# Altium schematic sheet RF.SchDoc
size A4; SheetNumber: 4; SheetTotal: 5
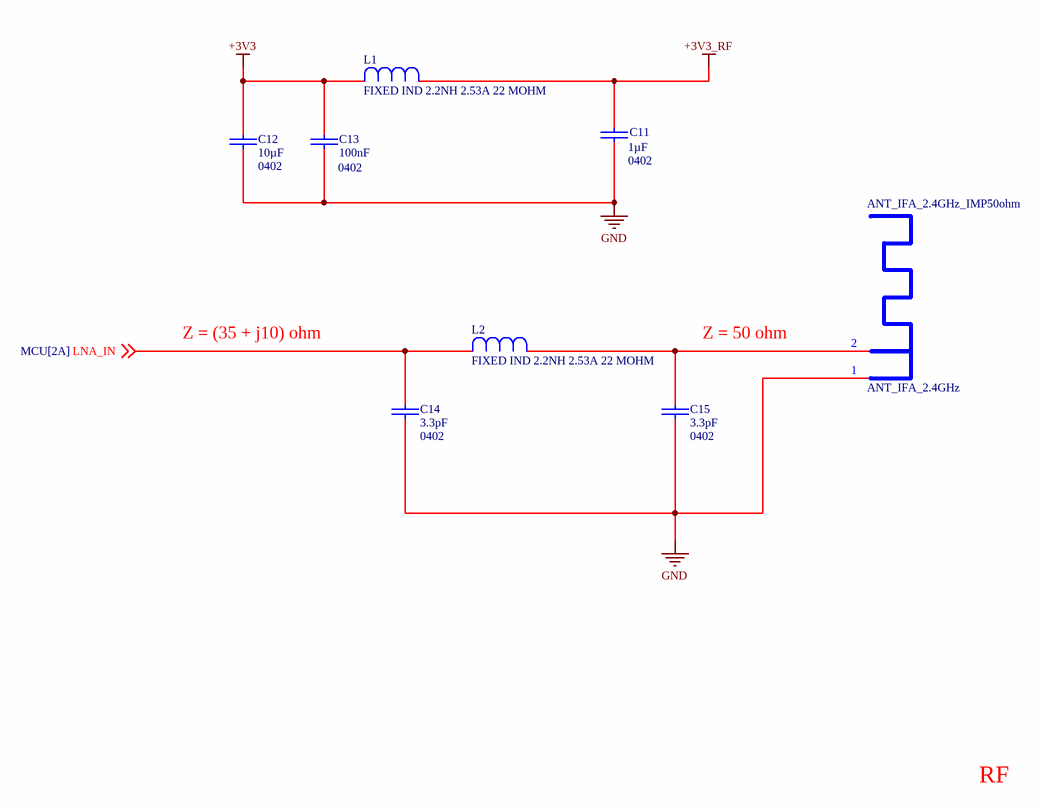
[diagram p0: RF.SchDoc]

## Parts
ANT_IFA_2.4GHz_IMP50ohm  ANT_IFA_2.4GHz  [ANT_IFA_2.4GHz]
C11  value 1µF  Case/Package: 0402  [C0402]  (hidden comment: CAP CER 1UF 10V X5R 0402)
C12  value 10µF  Case/Package: 0402  [C0402]  (hidden comment: CAP CER 10UF 10V X5R 0402)
C13  value 100nF  Case/Package: 0402  [C0402]  (hidden comment: CAP CER 100nF 50V X5R 0402)
C14  value 3.3pF  Case/Package: 0402  [C0402]  (hidden comment: GRM1555C2A3R3CA01D)
C15  value 3.3pF  Case/Package: 0402  [C0402]  (hidden comment: GRM1555C2A3R3CA01D)
L1  FIXED IND 2.2NH 2.53A 22 MOHM  [INDC1006X60N]
L2  FIXED IND 2.2NH 2.53A 22 MOHM  [INDC1006X60N]

## Nets
+3V3: C12.2 C13.2 L1.2
+3V3_RF: C11.2 L1.1
GND: ANT_IFA_2.4GHz_IMP50ohm.1 C11.1 C12.1 C13.1 C14.1 C15.1
LNA_IN: C14.2 L2.2 ; off-sheet LNA_IN
NetANT_IFA_2.4GHz_IMP50ohm_2: ANT_IFA_2.4GHz_IMP50ohm.2 C15.2 L2.1

## Notes on the sheet
- Z = (35 + j10) ohm
- Z = 50 ohm
- RF

## Library data of the parts
C11 = CC0402KRX5R6BB105: Multilayer Ceramic Capacitors MLCC – SMD/SMT; YAGEO; CC0402KRX5R6BB105; 1 µF; 0402; 10 V; 10 V; Manufacturer: Yageo Group; Dissipation Factor: 15%; Temperature Coefficient: 30ppm/°C; Tolerance: 10%; Supplier: DigiKey; Supplier Part Number: 311-1439-1-ND; Manufacturer Part Number: CC0402KRX5R6BB105; RoHS: Compliant; Category: Ceramic Capacitors; Stock: 575623; Pricing: 1=0,11, 10=0,06, 50=0,0412, 100=0,0356, 500=0,02612, 1000=0,02323, 2500=0,02018, 5000=0,01835 (USD); Case Code (Imperial): 0402; Case Code (Metric): 1005; China RoHS: Compliant; Composition: Ceramic; Country of Origin: Mainland China, Taiwan; Depth: 500µm; Dielectric: X5R; Dielectric Material: Ceramic; Export Control Classification Number (ECCN) Code: EAR99; Halogen Free: Halogen Free; Height: 500µm; Harmonized Tariff Schedule (HTS) Code: 8532.24.00.20; Introduction Date: 2009-04-16; Lead Free: Lead Free; Length: 1mm; Lifecycle Status: Production; Material: Ceramic; Max Operating Temperature: 85°C; Min Operating Temperature: -55°C; Mounting Technology: Surface Mount; Pins: 2; Number of Terminals: 2; Packaging: Cut Tape (CT); Radiation Hardening: No; REACH SVHC: Yes; Schedule B: 8532240020, 8532240020|8532240020|8532240020|8532240020|8532240020|8532240020|8532240020|8532240020|8532240020|8532240020|8532240020|8532240020|8532240020|8532240020|8532240020|8532240020|8532240020|8532240020|8532240020|8532240020|8532240020|8532240020|8532240020|85; Termination: SMD/SMT; Thickness: 558.8µm; Voltage Rating: 10V; Voltage Rating (DC): 10V; Width: 500µm; ComponentLink1URL: https://datasheet.octopart.com:443/CC0402KRX5R6BB105-Yageo-datasheet-170350636.pdf?src-supplier=IHS; ComponentLink1Description: https://datasheet.octopart.com:443/CC0402KRX5R6BB105-Yageo-datasheet-170350636.pdf?src-supplier=IHS; ComponentLink2URL: https://datasheet.octopart.com:443/CC0402KRX5R6BB105-Yageo-datasheet-10911834.pdf?src-supplier=Farnell; ComponentLink2Description: https://datasheet.octopart.com:443/CC0402KRX5R6BB105-Yageo-datasheet-10911834.pdf?src-supplier=Farnell; ComponentLink3URL: https://datasheet.octopart.com:443/CC0402KRX5R6BB105-Yageo-datasheet-78855684.pdf?src-supplier=Upverter; ComponentLink3Description: https://datasheet.octopart.com:443/CC0402KRX5R6BB105-Yageo-datasheet-78855684.pdf?src-supplier=Upverter; ComponentLink4URL: https://datasheet.octopart.com:443/CC0402KRX5R6BB105-Yageo-datasheet-8324442.pdf?src-supplier=element14+APAC; ComponentLink4Description: https://datasheet.octopart.com:443/CC0402KRX5R6BB105-Yageo-datasheet-8324442.pdf?src-supplier=element14+APAC; ComponentLink5URL: https://datasheet.octopart.com:443/CC0402KRX5R6BB105-Yageo-datasheet-181967186.pdf?src-supplier=Newark; ComponentLink5Description: https://datasheet.octopart.com:443/CC0402KRX5R6BB105-Yageo-datasheet-181967186.pdf?src-supplier=Newark; ComponentLink6URL: https://datasheet.octopart.com:443/CC0402KRX5R6BB105-Yageo-datasheet-181967185.pdf?src-supplier=Newark; ComponentLink6Description: https://datasheet.octopart.com:443/CC0402KRX5R6BB105-Yageo-datasheet-181967185.pdf?src-supplier=Newark; ComponentLink7URL: https://datasheet.octopart.com:443/CC0402KRX5R6BB105-Yageo-datasheet-519481.pdf?src-supplier=Newark; ComponentLink7Description: https://datasheet.octopart.com:443/CC0402KRX5R6BB105-Yageo-datasheet-519481.pdf?src-supplier=Newark; ComponentLink8URL: https://datasheet.octopart.com:443/CC0402KRX5R6BB105-Yageo-datasheet-62067349.pdf?src-supplier=Newark; ComponentLink8Description: https://datasheet.octopart.com:443/CC0402KRX5R6BB105-Yageo-datasheet-62067349.pdf?src-supplier=Newark; ComponentLink9URL: https://datasheet.octopart.com:443/CC0402KRX5R6BB105-Yageo-datasheet-169689537.pdf?src-supplier=Newark; ComponentLink9Description: https://datasheet.octopart.com:443/CC0402KRX5R6BB105-Yageo-datasheet-169689537.pdf?src-supplier=Newark; ComponentLink10URL: https://datasheet.octopart.com:443/CC0402KRX5R6BB105-Yageo-datasheet-158238148.pdf?src-supplier=JRH+Electronics; ComponentLink10Description: https://datasheet.octopart.com:443/CC0402KRX5R6BB105-Yageo-datasheet-158238148.pdf?src-supplier=JRH+Electronics; ComponentLink11URL: https://datasheet.octopart.com/CC0402KRX5R6BB105-Yageo-datasheet-86397281.pdf; ComponentLink11Description: https://datasheet.octopart.com/CC0402KRX5R6BB105-Yageo-datasheet-86397281.pdf; ComponentLink12URL: https://datasheet.octopart.com:443/CC0402KRX5R6BB105-Yageo-datasheet-149070021.pdf?src-supplier=TME; ComponentLink12Description: https://datasheet.octopart.com:443/CC0402KRX5R6BB105-Yageo-datasheet-149070021.pdf?src-supplier=TME; ComponentLink13URL: https://datasheet.octopart.com:443/CC0402KRX5R6BB105-Yageo-Group-datasheet-145016144.pdf?src-supplier=ODG+(Origin+Data+Global); ComponentLink13Description: https://datasheet.octopart.com:443/CC0402KRX5R6BB105-Yageo-Group-datasheet-145016144.pdf?src-supplier=ODG+(Origin+Data+Global); ComponentLink14URL: https://datasheet.octopart.com:443/CC0402KRX5R6BB105-Yageo-datasheet-137875056.pdf?src-supplier=Future+Electronics; ComponentLink14Description: https://datasheet.octopart.com:443/CC0402KRX5R6BB105-Yageo-datasheet-137875056.pdf?src-supplier=Future+Electronics; ComponentLink15URL: https://datasheet.octopart.com:443/CC0402KRX5R6BB105-Yageo-datasheet-137700085.pdf?src-supplier=Future+Electronics; ComponentLink15Description: https://datasheet.octopart.com:443/CC0402KRX5R6BB105-Yageo-datasheet-137700085.pdf?src-supplier=Future+Electronics; ComponentLink16URL: https://datasheet.octopart.com:443/CC0402KRX5R6BB105-Yageo-datasheet-59875459.pdf?src-supplier=Future+Electronics; ComponentLink16Description: https://datasheet.octopart.com:443/CC0402KRX5R6BB105-Yageo-datasheet-59875459.pdf?src-supplier=Future+Electronics; ComponentLink17URL: https://datasheet.octopart.com:443/CC0402KRX5R6BB105-Yageo-datasheet-24578986.pdf?src-supplier=Future+Electronics; ComponentLink17Description: https://datasheet.octopart.com:443/CC0402KRX5R6BB105-Yageo-datasheet-24578986.pdf?src-supplier=Future+Electronics; ComponentLink18URL: https://datasheet.octopart.com:443/CC0402KRX5R6BB105-Yageo-datasheet-8701639.pdf?src-supplier=element14; ComponentLink18Description: https://datasheet.octopart.com:443/CC0402KRX5R6BB105-Yageo-datasheet-8701639.pdf?src-supplier=element14; ComponentLink19URL: https://datasheet.octopart.com:443/CC0402KRX5R6BB105-Yageo-datasheet-68071816.pdf?src-supplier=Megastar; ComponentLink19Description: https://datasheet.octopart.com:443/CC0402KRX5R6BB105-Yageo-datasheet-68071816.pdf?src-supplier=Megastar; ComponentLink20URL: http://sigma.octopart.com:80/conflict_mineral_statement/Yageo-company-3.pdf?src-supplier=Compliance+Statements; ComponentLink20Description: http://sigma.octopart.com:80/conflict_mineral_statement/Yageo-company-3.pdf?src-supplier=Compliance+Statements; ComponentLink21URL: http://sigma.octopart.com:80/rohs_statement/Yageo-company-2.pdf?src-supplier=Compliance+Statements; ComponentLink21Description: http://sigma.octopart.com:80/rohs_statement/Yageo-company-2.pdf?src-supplier=Compliance+Statements; LCSC Part: C106254
C12 = GRM155R61A106ME11D: 10V 10uF X5R ±20% 0402 Multilayer Ceramic Capacitors MLCC - SMD/SMT ROHS; Manufacturer: Murata; Manufacturer Lifecycle Status: IN PRODUCTION; Supplier: DigiKey; Supplier Part Number: 490-GRM155R61A106ME11DCT-ND; Manufacturer Part Number: GRM155R61A106ME11D; RoHS: Compliant; Category: Ceramic Capacitors; Stock: 2420356; Pricing: 1=0,11, 10=0,063, 50=0,0436, 100=0,0376, 500=0,02772, 1000=0,02467, 2500=0,02148, 5000=0,01955 (USD); Country of Origin: Philippines; Dielectric: X5R; Dielectric Material: Ceramic; Export Control Classification Number (ECCN) Code: EAR99; Height: 500µm; Harmonized Tariff Schedule (HTS) Code: 8532.24.00.20; Introduction Date: 2018-10-26; Length: 1mm; Lifecycle Status: Production; Material: Ceramic; Max Operating Temperature: 85°C; Min Operating Temperature: -55°C; Mounting Technology: Surface Mount; Number of Terminals: 2; REACH SVHC: Yes; Thickness: 500µm; Tolerance: 20%; Voltage Rating: 10V; Voltage Rating (DC): 10V; Width: 500µm; ComponentLink1URL: https://datasheet.octopart.com:443/GRM155R61A106ME11D-Murata-datasheet-155239053.pdf?src-supplier=Newark; ComponentLink1Description: https://datasheet.octopart.com:443/GRM155R61A106ME11D-Murata-datasheet-155239053.pdf?src-supplier=Newark; ComponentLink2URL: https://datasheet.octopart.com:443/GRM155R61A106ME11D-Murata-datasheet-178522865.pdf?src-supplier=Arrow.cn; ComponentLink2Description: https://datasheet.octopart.com:443/GRM155R61A106ME11D-Murata-datasheet-178522865.pdf?src-supplier=Arrow.cn; ComponentLink3URL: https://datasheet.octopart.com:443/GRM155R61A106ME11D-Murata-datasheet-165579666.pdf?src-supplier=TME; ComponentLink3Description: https://datasheet.octopart.com:443/GRM155R61A106ME11D-Murata-datasheet-165579666.pdf?src-supplier=TME; ComponentLink4URL: https://datasheet.octopart.com:443/GRM155R61A106ME11D-Murata-datasheet-141266224.pdf?src-supplier=Ciiva; ComponentLink4Description: https://datasheet.octopart.com:443/GRM155R61A106ME11D-Murata-datasheet-141266224.pdf?src-supplier=Ciiva; ComponentLink5URL: https://datasheet.octopart.com:443/GRM155R61A106ME11D-Murata-datasheet-140689744.pdf?src-supplier=Ciiva; ComponentLink5Description: https://datasheet.octopart.com:443/GRM155R61A106ME11D-Murata-datasheet-140689744.pdf?src-supplier=Ciiva; ComponentLink6URL: https://datasheet.octopart.com:443/GRM155R61A106ME11D-Murata-datasheet-138740692.pdf?src-supplier=Ciiva; ComponentLink6Description: https://datasheet.octopart.com:443/GRM155R61A106ME11D-Murata-datasheet-138740692.pdf?src-supplier=Ciiva; ComponentLink7URL: https://datasheet.octopart.com/GRM155R61A106ME11D-Murata-datasheet-12515295.pdf; ComponentLink7Description: https://datasheet.octopart.com/GRM155R61A106ME11D-Murata-datasheet-12515295.pdf; ComponentLink8URL: https://datasheet.octopart.com/GRM155R61A106ME11D-Murata-datasheet-12510076.pdf; ComponentLink8Description: https://datasheet.octopart.com/GRM155R61A106ME11D-Murata-datasheet-12510076.pdf; ComponentLink9URL: https://datasheet.octopart.com/GRM155R61A106ME11D-Murata-datasheet-11978611.pdf; ComponentLink9Description: https://datasheet.octopart.com/GRM155R61A106ME11D-Murata-datasheet-11978611.pdf; ComponentLink10URL: https://datasheet.octopart.com/GRM155R61A106ME11D-Murata-datasheet-10025737.pdf; ComponentLink10Description: https://datasheet.octopart.com/GRM155R61A106ME11D-Murata-datasheet-10025737.pdf; ComponentLink11URL: https://datasheet.octopart.com/GRM155R61A106ME11D-Murata-datasheet-8819587.pdf; ComponentLink11Description: https://datasheet.octopart.com/GRM155R61A106ME11D-Murata-datasheet-8819587.pdf; ComponentLink12URL: http://sigma.octopart.com:80/reach_statement/Murata-company-16.pdf?src-supplier=Compliance+Statements; ComponentLink12Description: http://sigma.octopart.com:80/reach_statement/Murata-company-16.pdf?src-supplier=Compliance+Statements; LCSC Part: C408132
C13 = CC0402KRX5R9BB104: 50V 100nF X5R ±10% 0402 Multilayer Ceramic Capacitors MLCC - SMD/SMT ROHS; Manufacturer: Yageo Group; Temperature Coefficient: 30ppm/°C; Supplier: DigiKey; Supplier Part Number: 311-3342-2-ND; Manufacturer Part Number: CC0402KRX5R9BB104; RoHS: Compliant; Category: Ceramic Capacitors; Stock: 2840000; Pricing: 10000=0,00742, 20000=0,00677, 30000=0,00644, 50000=0,00608, 70000=0,00587, 100000=0,00567 (USD); China RoHS: Compliant; Country of Origin: Mainland China, Taiwan; Dielectric Material: Ceramic; Export Control Classification Number (ECCN) Code: EAR99; Halogen Free: Halogen Free; Height: 500µm; Harmonized Tariff Schedule (HTS) Code: 8532.24.00.20; Introduction Date: 2013-02-05; Lead Free: Lead Free; Length: 1mm; Lifecycle Status: Production; Material: Ceramic; Max Operating Temperature: 85°C; Min Operating Temperature: -55°C; Mounting Technology: Surface Mount; Number of Terminals: 2; REACH SVHC: Yes; Schedule B: 8532240020, 8532240020|8532240020|8532240020|8532240020|8532240020|8532240020|8532240020|8532240020|8532240020|8532240020|8532240020|8532240020|8532240020|8532240020|8532240020|8532240020|8532240020|8532240020|8532240020|8532240020|8532240020|8532240020|8532240020|85; Thickness: 558.8µm; Voltage Rating: 50V; Voltage Rating (DC): 50V; Width: 500µm; ComponentLink1URL: https://datasheet.octopart.com:443/CC0402KRX5R9BB104-Yageo-datasheet-170350636.pdf?src-supplier=IHS; ComponentLink1Description: https://datasheet.octopart.com:443/CC0402KRX5R9BB104-Yageo-datasheet-170350636.pdf?src-supplier=IHS; ComponentLink2URL: https://datasheet.octopart.com:443/CC0402KRX5R9BB104-Yageo-datasheet-78855684.pdf?src-supplier=Upverter; ComponentLink2Description: https://datasheet.octopart.com:443/CC0402KRX5R9BB104-Yageo-datasheet-78855684.pdf?src-supplier=Upverter; ComponentLink3URL: https://datasheet.octopart.com:443/CC0402KRX5R9BB104-Yageo-datasheet-140260304.pdf?src-supplier=Newark; ComponentLink3Description: https://datasheet.octopart.com:443/CC0402KRX5R9BB104-Yageo-datasheet-140260304.pdf?src-supplier=Newark; ComponentLink4URL: https://datasheet.octopart.com:443/CC0402KRX5R9BB104-Yageo-datasheet-158238148.pdf?src-supplier=Newark; ComponentLink4Description: https://datasheet.octopart.com:443/CC0402KRX5R9BB104-Yageo-datasheet-158238148.pdf?src-supplier=Newark; ComponentLink5URL: https://datasheet.octopart.com:443/CC0402KRX5R9BB104-Yageo-datasheet-182029422.pdf?src-supplier=Farnell; ComponentLink5Description: https://datasheet.octopart.com:443/CC0402KRX5R9BB104-Yageo-datasheet-182029422.pdf?src-supplier=Farnell; ComponentLink6URL: https://datasheet.octopart.com/CC0402KRX5R9BB104-Yageo-datasheet-86397281.pdf; ComponentLink6Description: https://datasheet.octopart.com/CC0402KRX5R9BB104-Yageo-datasheet-86397281.pdf; ComponentLink7URL: https://datasheet.octopart.com:443/CC0402KRX5R9BB104-Yageo-datasheet-149070021.pdf?src-supplier=TME; ComponentLink7Description: https://datasheet.octopart.com:443/CC0402KRX5R9BB104-Yageo-datasheet-149070021.pdf?src-supplier=TME; ComponentLink8URL: https://datasheet.octopart.com:443/CC0402KRX5R9BB104-Yageo-Group-datasheet-145016144.pdf?src-supplier=ODG+(Origin+Data+Global); ComponentLink8Description: https://datasheet.octopart.com:443/CC0402KRX5R9BB104-Yageo-Group-datasheet-145016144.pdf?src-supplier=ODG+(Origin+Data+Global); ComponentLink9URL: https://datasheet.octopart.com:443/CC0402KRX5R9BB104-Yageo-datasheet-137875056.pdf?src-supplier=Future+Electronics; ComponentLink9Description: https://datasheet.octopart.com:443/CC0402KRX5R9BB104-Yageo-datasheet-137875056.pdf?src-supplier=Future+Electronics; ComponentLink10URL: https://datasheet.octopart.com:443/CC0402KRX5R9BB104-Yageo-datasheet-137700085.pdf?src-supplier=Future+Electronics; ComponentLink10Description: https://datasheet.octopart.com:443/CC0402KRX5R9BB104-Yageo-datasheet-137700085.pdf?src-supplier=Future+Electronics; ComponentLink11URL: https://datasheet.octopart.com:443/CC0402KRX5R9BB104-Yageo-datasheet-62067349.pdf?src-supplier=Future+Electronics; ComponentLink11Description: https://datasheet.octopart.com:443/CC0402KRX5R9BB104-Yageo-datasheet-62067349.pdf?src-supplier=Future+Electronics; ComponentLink12URL: https://datasheet.octopart.com:443/CC0402KRX5R9BB104-Yageo-datasheet-68071816.pdf?src-supplier=Future+Electronics; ComponentLink12Description: https://datasheet.octopart.com:443/CC0402KRX5R9BB104-Yageo-datasheet-68071816.pdf?src-supplier=Future+Electronics; ComponentLink13URL: https://datasheet.octopart.com:443/CC0402KRX5R9BB104-Yageo-datasheet-68297942.pdf?src-supplier=Future+Electronics; ComponentLink13Description: https://datasheet.octopart.com:443/CC0402KRX5R9BB104-Yageo-datasheet-68297942.pdf?src-supplier=Future+Electronics; ComponentLink14URL: http://sigma.octopart.com:80/conflict_mineral_statement/Yageo-company-3.pdf?src-supplier=Compliance+Statements; ComponentLink14Description: http://sigma.octopart.com:80/conflict_mineral_statement/Yageo-company-3.pdf?src-supplier=Compliance+Statements; ComponentLink15URL: http://sigma.octopart.com:80/rohs_statement/Yageo-company-2.pdf?src-supplier=Compliance+Statements; ComponentLink15Description: http://sigma.octopart.com:80/rohs_statement/Yageo-company-2.pdf?src-supplier=Compliance+Statements; LCSC Part: C105882; Tolerance: 10%; Dielectric: X5R
C14 C15 = GRM1555C2A3R3CA01D: Cap Ceramic 3.3pF 100V C0G 0.25pF Pad SMD 0402 125C T/R; Manufacturer: Murata; Manufacturer Lifecycle Status: NRND; Supplier: DigiKey; Supplier Part Number: 490-7287-1-ND; Manufacturer Part Number: GRM1555C2A3R3CA01D; RoHS: Compliant; Category: Ceramic Capacitors; Stock: 812516; Pricing: 1=0,1, 10=0,031, 50=0,0208, 100=0,0176, 500=0,01252, 1000=0,01095, 2500=0,0093, 5000=0,00832 (USD); Case Code (Imperial): 0402; Case Code (Metric): 1005; Dielectric: C0G; Dielectric Material: Ceramic; Export Control Classification Number (ECCN) Code: EAR99; Height: 500µm; Harmonized Tariff Schedule (HTS) Code: 8532.24.00.20; Introduction Date: 2013-11-20; Length: 1mm; Lifecycle Status: NRND; Max Operating Temperature: 125°C; Min Operating Temperature: -55°C; Mounting Technology: Surface Mount; Number of Terminals: 2; REACH SVHC: Yes; Termination: SMD/SMT; Thickness: 500µm; Voltage Rating: 100V; Voltage Rating (DC): 100V; Weight: 6.010099mg; Width: 500µm; ComponentLink1URL: https://datasheet.octopart.com:443/GRM1555C2A3R3CA01D-Murata-datasheet-165579666.pdf?src-supplier=TME; ComponentLink1Description: https://datasheet.octopart.com:443/GRM1555C2A3R3CA01D-Murata-datasheet-165579666.pdf?src-supplier=TME; ComponentLink2URL: https://datasheet.octopart.com:443/GRM1555C2A3R3CA01D-Murata-datasheet-141266224.pdf?src-supplier=Ciiva; ComponentLink2Description: https://datasheet.octopart.com:443/GRM1555C2A3R3CA01D-Murata-datasheet-141266224.pdf?src-supplier=Ciiva; ComponentLink3URL: https://datasheet.octopart.com:443/GRM1555C2A3R3CA01D-Murata-datasheet-140684059.pdf?src-supplier=Ciiva; ComponentLink3Description: https://datasheet.octopart.com:443/GRM1555C2A3R3CA01D-Murata-datasheet-140684059.pdf?src-supplier=Ciiva; ComponentLink4URL: https://datasheet.octopart.com:443/GRM1555C2A3R3CA01D-Murata-datasheet-138740022.pdf?src-supplier=Ciiva; ComponentLink4Description: https://datasheet.octopart.com:443/GRM1555C2A3R3CA01D-Murata-datasheet-138740022.pdf?src-supplier=Ciiva; ComponentLink5URL: https://datasheet.octopart.com:443/GRM1555C2A3R3CA01D-Murata-datasheet-96971104.pdf?src-supplier=Future+Electronics; ComponentLink5Description: https://datasheet.octopart.com:443/GRM1555C2A3R3CA01D-Murata-datasheet-96971104.pdf?src-supplier=Future+Electronics; ComponentLink6URL: https://datasheet.octopart.com/GRM1555C2A3R3CA01D-Murata-datasheet-12515295.pdf; ComponentLink6Description: https://datasheet.octopart.com/GRM1555C2A3R3CA01D-Murata-datasheet-12515295.pdf; ComponentLink7URL: https://datasheet.octopart.com/GRM1555C2A3R3CA01D-Murata-datasheet-12510076.pdf; ComponentLink7Description: https://datasheet.octopart.com/GRM1555C2A3R3CA01D-Murata-datasheet-12510076.pdf; ComponentLink8URL: https://datasheet.octopart.com/GRM1555C2A3R3CA01D-Murata-datasheet-11978611.pdf; ComponentLink8Description: https://datasheet.octopart.com/GRM1555C2A3R3CA01D-Murata-datasheet-11978611.pdf; ComponentLink9URL: https://datasheet.octopart.com/GRM1555C2A3R3CA01D-Murata-datasheet-10025737.pdf; ComponentLink9Description: https://datasheet.octopart.com/GRM1555C2A3R3CA01D-Murata-datasheet-10025737.pdf; ComponentLink10URL: https://datasheet.octopart.com/GRM1555C2A3R3CA01D-Murata-datasheet-8819587.pdf; ComponentLink10Description: https://datasheet.octopart.com/GRM1555C2A3R3CA01D-Murata-datasheet-8819587.pdf; ComponentLink11URL: https://datasheet.octopart.com/GRM1555C2A3R3CA01D-Murata-datasheet-17504032.pdf; ComponentLink11Description: https://datasheet.octopart.com/GRM1555C2A3R3CA01D-Murata-datasheet-17504032.pdf; ComponentLink12URL: http://sigma.octopart.com:80/reach_statement/Murata-company-16.pdf?src-supplier=Compliance+Statements; ComponentLink12Description: http://sigma.octopart.com:80/reach_statement/Murata-company-16.pdf?src-supplier=Compliance+Statements; LCSC Part: C3861813
L1 L2 = LQW15AN2N2G80D: General Purpose Inductor, 0.0022uH, 2%, 1 Element, Wirewound-Core, Reflow soldering, 1005/0402; Manufacturer: Murata; Manufacturer Lifecycle Status: IN PRODUCTION; Core Material: Non-Magnetic; DC Resistance (DCR): 22mΩ; Number of Circuits: 1; Q Factor: 30; Self Resonant Frequency: 15.5GHz; Shielding: Unshielded; Test Frequency: 250MHz; Supplier: DigiKey; Supplier Part Number: 490-LQW15AN2N2G80DCT-ND; Manufacturer Part Number: LQW15AN2N2G80D; RoHS: Compliant; Category: Fixed Inductors; Stock: 2001; Pricing: 1=0,16, 10=0,136, 25=0,1256, 50=0,1184, 100=0,1116, 250=0,10324, 500=0,09734, 1000=0,09176, 2500=0,0849 (USD); Case/Package: 0402; Composition: Wirewound; Country of Origin: Japan, Malaysia; Current Rating: 2.53A; Export Control Classification Number (ECCN) Code: EAR99; Height: 500µm; Harmonized Tariff Schedule (HTS) Code: 8504.50.80.00; Value: 2.2nH; Introduction Date: 2014-04-19; Length: 1mm; Lifecycle Status: Production; Max Current Rating: 2.53A; Max Operating Temperature: 125°C; Min Operating Temperature: -55°C; Number of Terminals: 2; REACH SVHC: Yes; RMS Current (Irms): 2.53A; Schedule B: 8504500000, 8504500000|8504500000|8504500000|8504500000|8504500000; ESR: 22mΩ; Tolerance: 2%; Width: 600µm; ComponentLink1URL: https://datasheet.octopart.com:443/LQW15AN2N2G80D-Murata-datasheet-140317598.pdf?src-supplier=element14+APAC; ComponentLink1Description: https://datasheet.octopart.com:443/LQW15AN2N2G80D-Murata-datasheet-140317598.pdf?src-supplier=element14+APAC; ComponentLink2URL: https://datasheet.octopart.com:443/LQW15AN2N2G80D-Murata-datasheet-142541253.pdf?src-supplier=Ciiva; ComponentLink2Description: https://datasheet.octopart.com:443/LQW15AN2N2G80D-Murata-datasheet-142541253.pdf?src-supplier=Ciiva; ComponentLink3URL: https://datasheet.octopart.com:443/LQW15AN2N2G80D-Murata-datasheet-141266224.pdf?src-supplier=Ciiva; ComponentLink3Description: https://datasheet.octopart.com:443/LQW15AN2N2G80D-Murata-datasheet-141266224.pdf?src-supplier=Ciiva; ComponentLink4URL: https://datasheet.octopart.com:443/LQW15AN2N2G80D-Murata-datasheet-140716489.pdf?src-supplier=Ciiva; ComponentLink4Description: https://datasheet.octopart.com:443/LQW15AN2N2G80D-Murata-datasheet-140716489.pdf?src-supplier=Ciiva; ComponentLink5URL: https://datasheet.octopart.com:443/LQW15AN2N2G80D-Murata-datasheet-138757552.pdf?src-supplier=Ciiva; ComponentLink5Description: https://datasheet.octopart.com:443/LQW15AN2N2G80D-Murata-datasheet-138757552.pdf?src-supplier=Ciiva; ComponentLink6URL: https://datasheet.octopart.com:443/LQW15AN2N2G80D-Murata-datasheet-145451984.pdf?src-supplier=Geoflip; ComponentLink6Description: https://datasheet.octopart.com:443/LQW15AN2N2G80D-Murata-datasheet-145451984.pdf?src-supplier=Geoflip; ComponentLink7URL: https://datasheet.octopart.com:443/LQW15AN2N2G80D-Murata-datasheet-140569559.pdf?src-supplier=Arrow.cn; ComponentLink7Description: https://datasheet.octopart.com:443/LQW15AN2N2G80D-Murata-datasheet-140569559.pdf?src-supplier=Arrow.cn; ComponentLink8URL: http://sigma.octopart.com:80/reach_statement/Murata-company-16.pdf?src-supplier=Compliance+Statements; ComponentLink8Description: http://sigma.octopart.com:80/reach_statement/Murata-company-16.pdf?src-supplier=Compliance+Statements